# Altium schematic sheet Driver.SchDoc
size OrCAD A
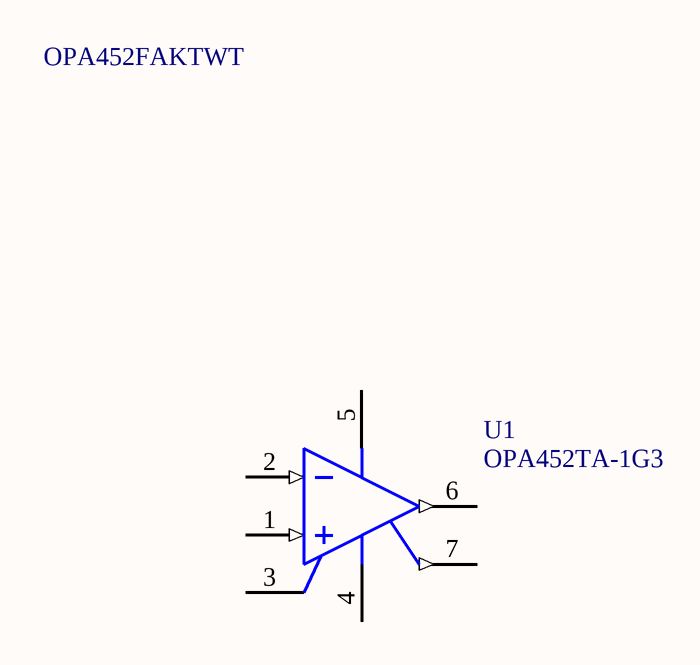
[diagram p0: Driver.SchDoc]

## Parts
U1  OPA452TA-1G3  [TI-KVT7]

## Nets

Not connected (* = marked no-connect by the designer): U1 1(VIN+) 2(VIN-) 3(NC) 4(V-) 5(V+) 6(VO) 7(FLAG)

## Notes on the sheet
- OPA452FAKTWT
- Title
- Size:
- Date:
- Orcad A
- Number:
- Time:
- Revision:
- Sheet
- of
- ZLS Corporation
- 7801 North Lamar Blvd.
- Suite E-184
- Austin, Texas 78752  USA
- (512) 453-0288
- File:

## Library data of the parts
U1 = CMP-0272-03698-3: Operational Amplifier, 20 to 80 V, -40 to 125 degC, 7-pin FM (KVT7), Green (RoHS & no Sb/Br); Manufacturer: Texas Instruments; Sub Family: High Output Current Amplifier (>=50mA), High Supply Voltage Amplifier (>=30V), Precision Amplifier; Vio (25C)(Max)(mV): 3; Total Supply Voltage(Min)(+5V is 5, +/-5V is 10): 20; IIB(Max)(pA): 100; Packing: TUBE; Number of Channels: 1; GBW(Typ)(MHz): 1.8; Slew Rate(Typ)(V/us): 10; Total Supply Voltage(Max)(+5V is 5, +/-5V is 10): 80; Iq per channel(Max)(mA): 6.5; CMRR(Min)(dB): 86; Offset Drift(Typ)(uV/C): 5; Rating: Catalog; PartNumber: OPA452TA-1G3; PackageDescription: 7-Pin Plastic Flange Mount, Body 10.16 x 4.495 mm, Pitch 1.27 mm; DatasheetVersion: SBOS127C; Mounting Technology: Through Hole; ComponentLink1URL: http://www.ti.com/; PackageVersion: 4204912/A, 01/2003; PackageReference: KVT7; ComponentLink2URL: http://www.ti.com/lit/ds/symlink/opa452.pdf; ComponentLink2Description: Datasheet; Eco-Plan: Green (RoHS & no Sb/Br); ComponentLink1Description: Manufacturer URL; ComponentLink3URL: http://www.ti.com/litv/pdf/mpzf004; ComponentLink3Description: Package Specification; RevisionNote: Footprint corrected